# EAGLE schematic roverPCB (EAGLE 9.2.2)
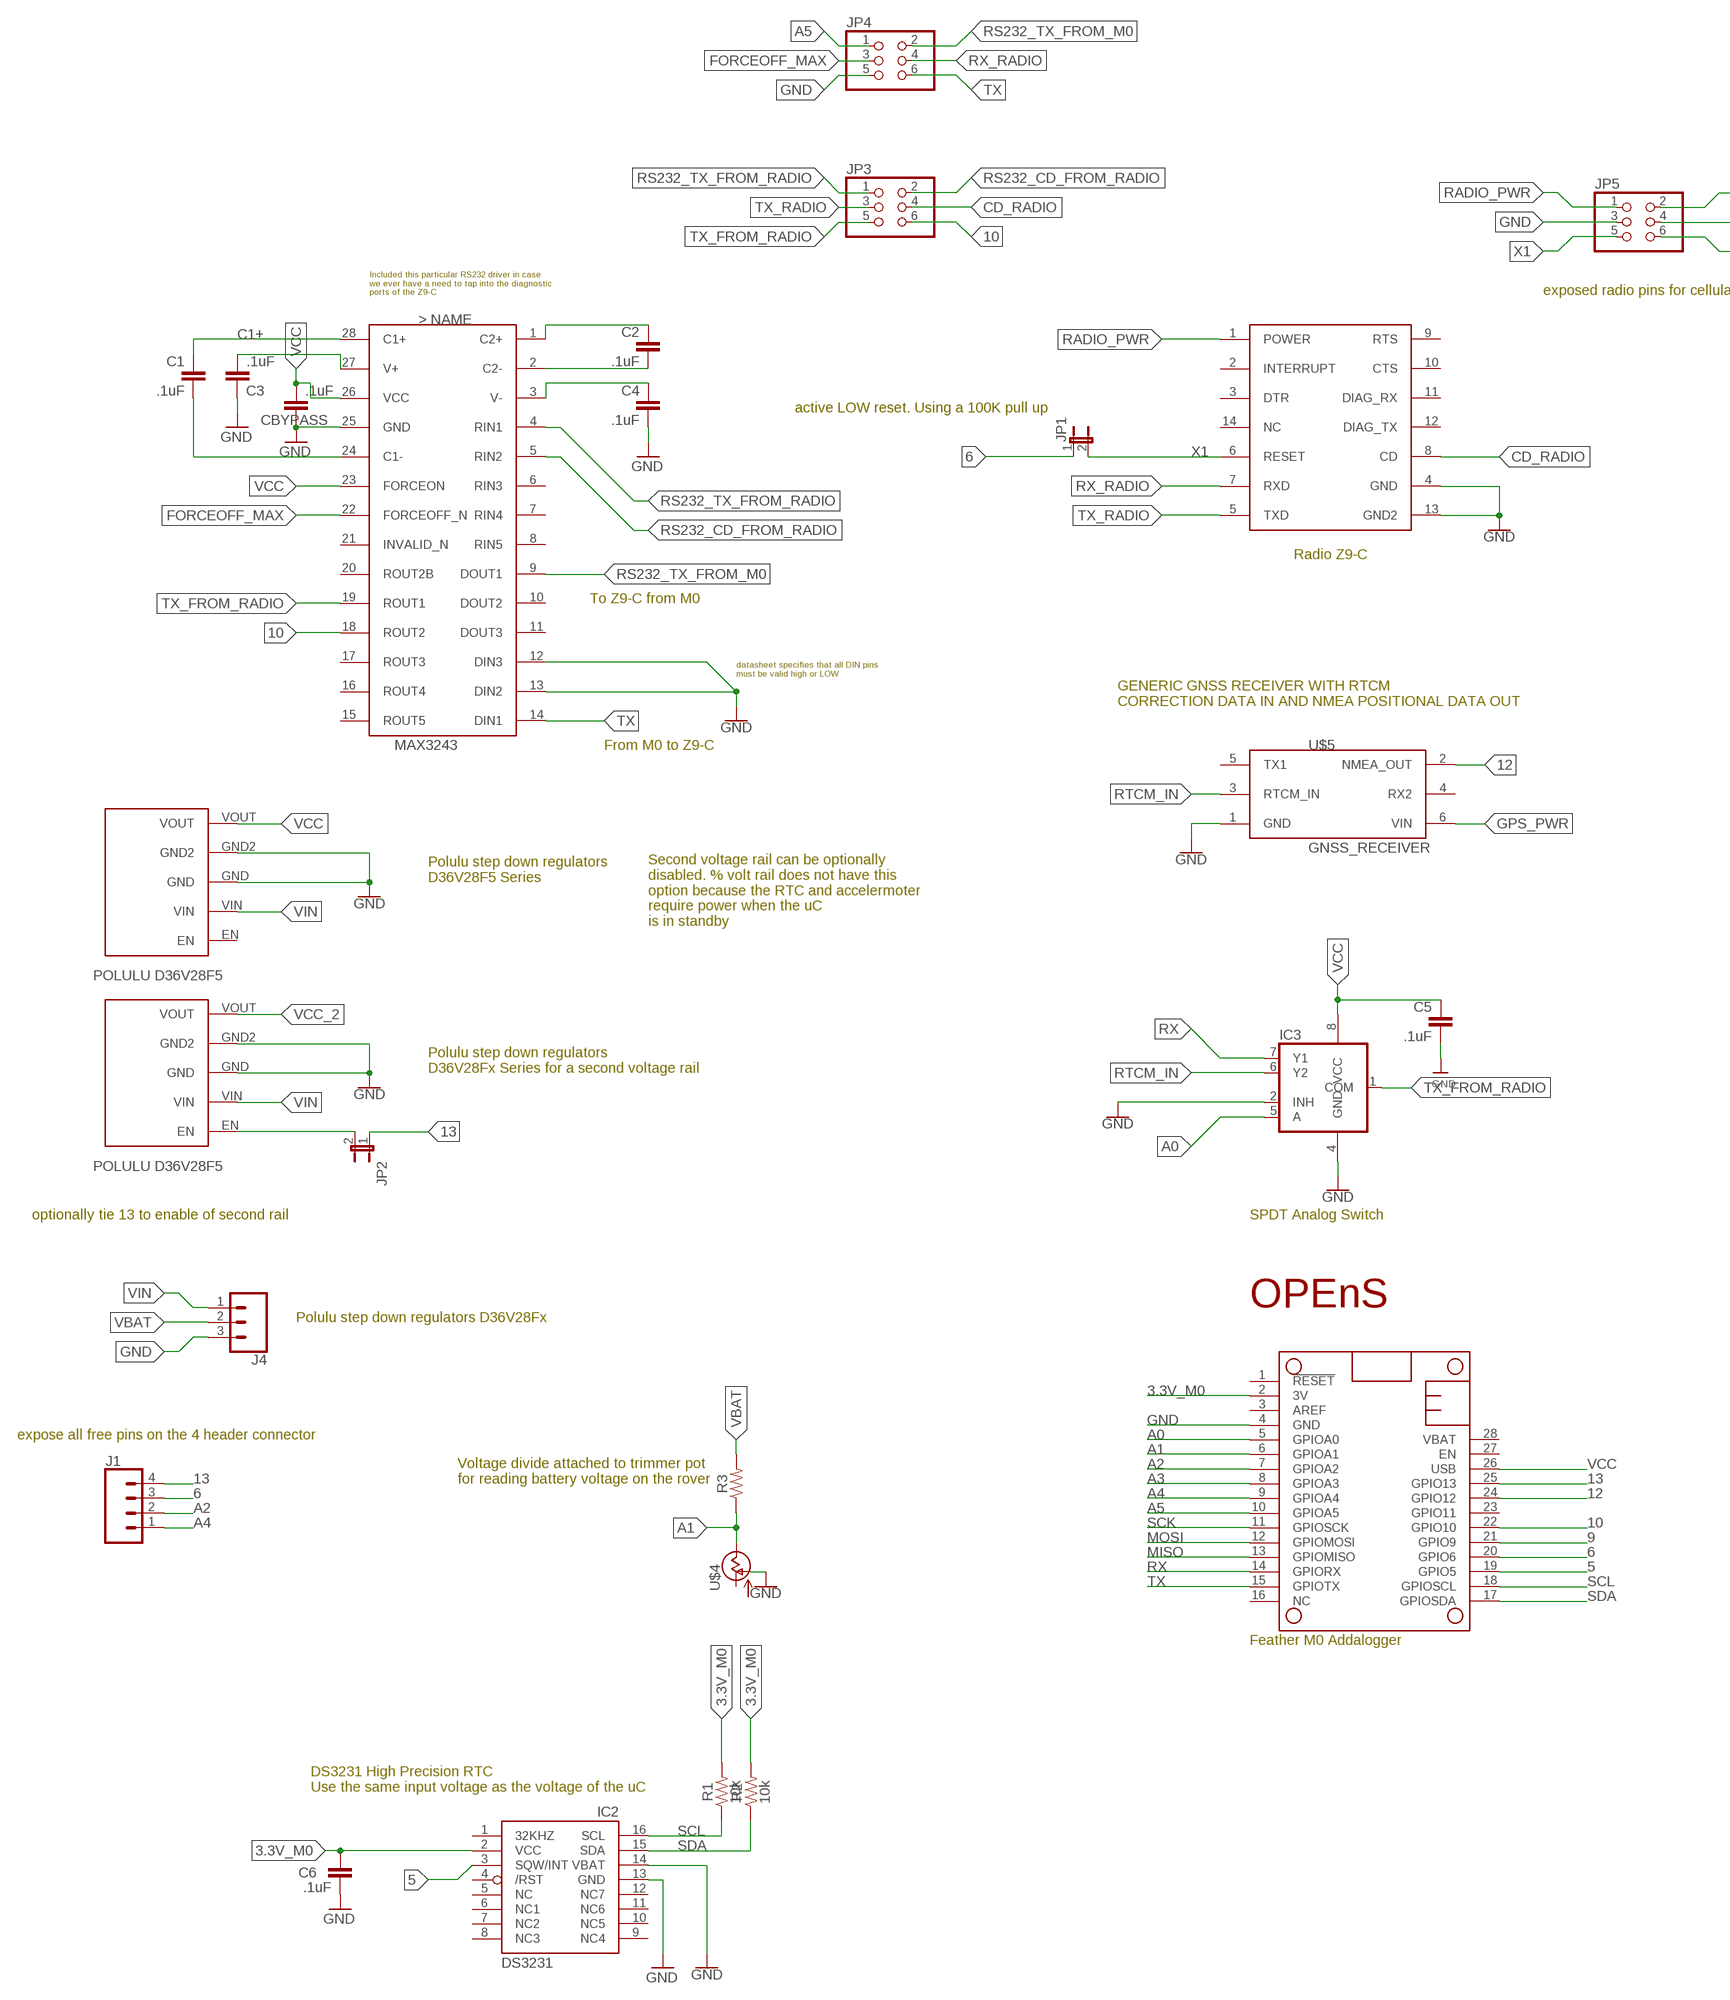
[diagram p0: schematic, sheet 1, part 1 of 2]
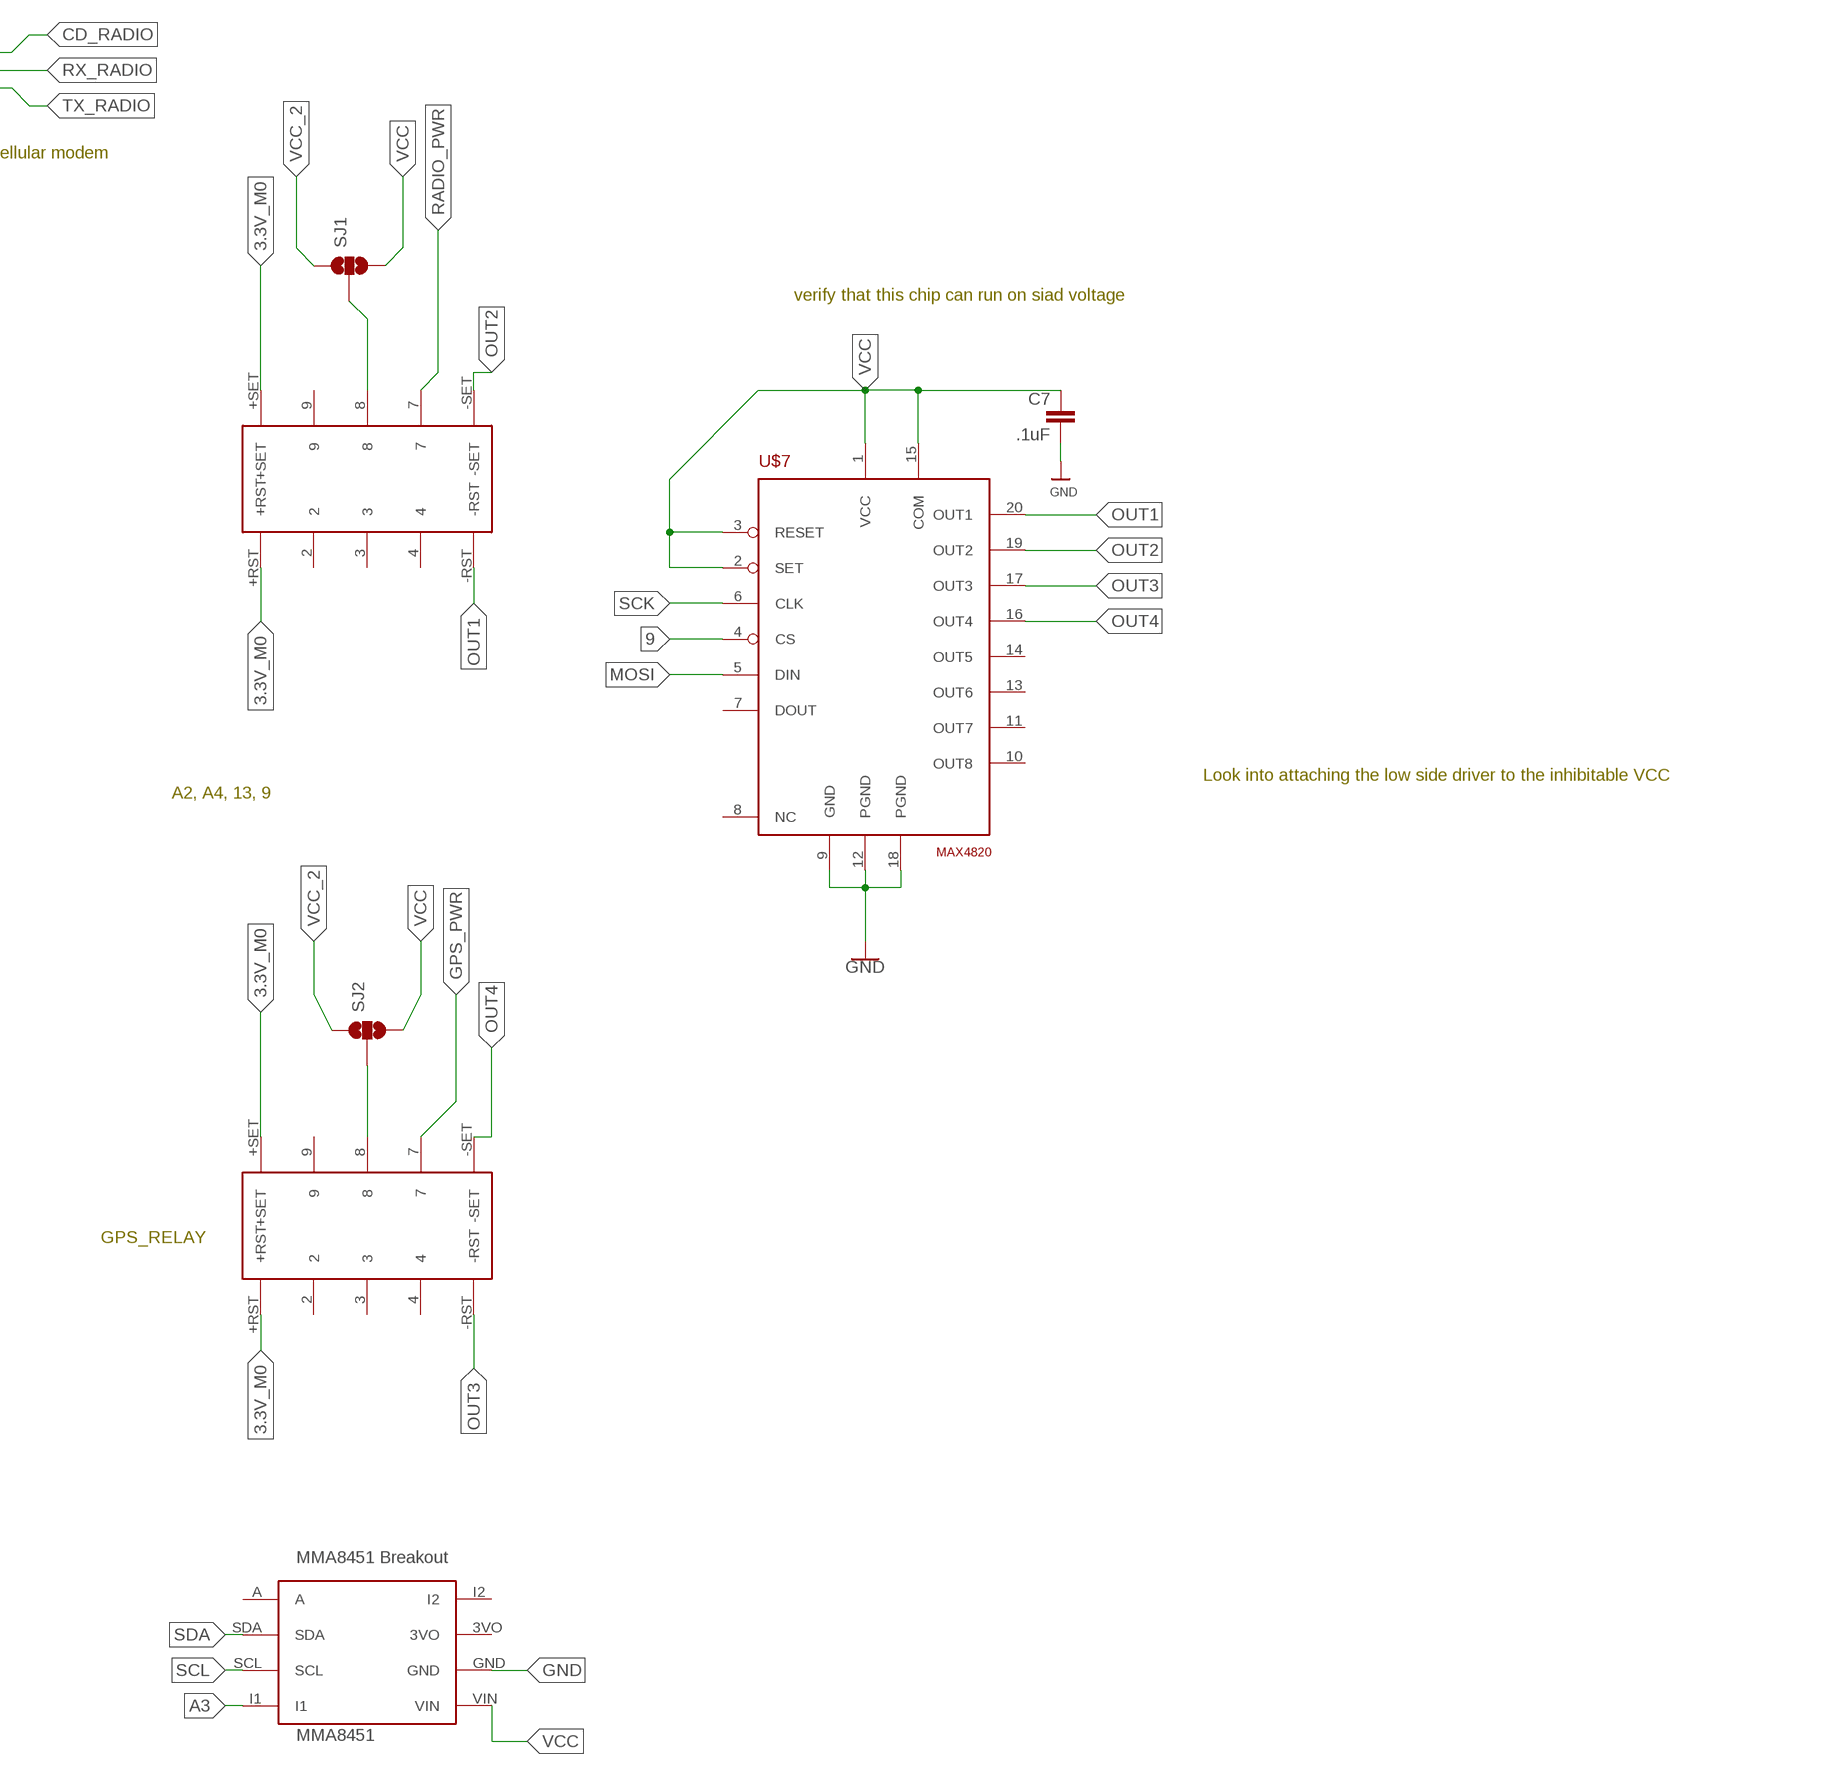
[diagram p1: schematic, sheet 1, part 2 of 2]

## Parts
C1  .1uF  CC1206  [C1206]
C2  .1uF  CC1206  [C1206]
C3  .1uF  CC1206  [C1206]
C4  .1uF  CC1206  [C1206]
C5  .1uF  CC1206  [C1206]
C6  .1uF  CC1206  [C1206]
C7  .1uF  CC1206  [C1206]
CBYPASS  .1uF  CC1206  [C1206]
IC2  DS3231/SO  [SO16W]
IC3  741G53DCT  [DCT_R-PDSO-G8]
J1  CONN_04  [1X04]
J4  CONN_03SCREW  [SCREWTERMINAL-3.5MM-3]
JP1  JP1E  [JP1]
JP2  JP1E  [JP1]
JP3  PINHD-2X3  [2X03]
JP4  PINHD-2X3  [2X03]
JP5  PINHD-2X3  [2X03]
MS1  FEATHERWING  [FEATHERWING]
R1  10k  0.27OHM-0603-1/10W-1%  [0603]
R2  10k  0.27OHM-0603-1/10W-1%  [0603]
R3  1.6KOHM-0603-1/10W-1%  [0603]
SJ1  SOLDERJUMPER_2WAY-OLDT  [SJ_2]
SJ2  SOLDERJUMPER_2WAY-OLDT  [SJ_2]
U$1  MAX3243  [SSOP-28]
U$2  OPENS-LOGO  [OPENS-LOGO]
U$3  POLULU_D36V28FX  [POLULU_D36V28FX]
U$4  CT6EP205  [CT6]
U$5  GNSS_RECEIVER  [MA03-2]
U$7  MAX4820  [TSSOP20]
U$8  TQ2SS  [TQ2SS]
U$9  TQ2SS  [TQ2SS]
U$11  Z9-T/Z9-C  [Z9-T/Z9-C]
U$12  POLULU_D36V28FX  [POLULU_D36V28FX]
U$13  MMA8451  [MMA8451]

## Nets
3.3V_M0: C6.1 IC2.2(VCC) MS1.2(3V) R1.2 R2.2 U$8.+RST U$8.+SET U$9.+RST U$9.+SET
5: IC2.3(SQW/INT) MS1.19(GPIO5)
6: J1.3 JP1.1 MS1.20(GPIO6)
9: MS1.21(GPIO9) U$7.4(CS)
10: JP3.6 MS1.22(GPIO10) U$1.18(ROUT2)
12: MS1.24(GPIO12) U$5.2(NMEA_OUT)
13: J1.4 JP2.1 MS1.25(GPIO13)
A0: IC3.5(A) MS1.5(GPIOA0)
A1: MS1.6(GPIOA1) R3.1 U$4.S(VSS)
A2: J1.2 MS1.7(GPIOA2)
A3: MS1.8(GPIOA3) U$13.I1
A4: J1.1 MS1.9(GPIOA4)
A5: JP4.1 MS1.10(GPIOA5)
C1+: C1.1 U$1.28(C1+)
CD_RADIO: JP3.4 JP5.2 U$11.8(CD)
FORCEOFF_MAX: JP4.3 U$1.22(FORCEOFF_N)
GND: C3.1 C4.2 C5.2 C6.2 C7.2 CBYPASS.1 IC2.13(GND) IC2.14(VBAT) IC3.2(INH) IC3.4(GND) J4.3 JP4.5 JP5.3 MS1.4(GND) U$1.12(DIN3) U$1.13(DIN2) U$1.25(GND) U$3.GND U$3.GND2 U$4.A(OUT) U$5.1(GND) U$7.9(GND) U$7.12(PGND) U$7.18(PGND) U$11.4(GND) U$11.13(GND2) U$12.GND U$12.GND2 U$13.GND
GPS_PWR: U$5.6(VIN) U$9.7
MISO: MS1.13(GPIOMISO)
MOSI: MS1.12(GPIOMOSI) U$7.5(DIN)
N$1: SJ2.2 U$9.8
N$2: SJ1.2 U$8.8
N$4: C2.1 U$1.1(C2+)
N$5: C2.2 U$1.2(C2-)
N$10: C4.1 U$1.3(V-)
N$11: C1.2 U$1.24(C1-)
N$13: C3.2 U$1.27(V+)
OUT1: U$7.20(OUT1) U$8.-RST
OUT2: U$7.19(OUT2) U$8.-SET
OUT3: U$7.17(OUT3) U$9.-RST
OUT4: U$7.16(OUT4) U$9.-SET
RADIO_PWR [Power]: JP5.1 U$8.7 U$11.1(POWER)
RS232_CD_FROM_RADIO: JP3.2 U$1.5(RIN2)
RS232_TX_FROM_M0: JP4.2 U$1.9(DOUT1)
RS232_TX_FROM_RADIO: JP3.1 U$1.4(RIN1)
RTCM_IN: IC3.6(Y2) U$5.3(RTCM_IN)
RX: IC3.7(Y1) MS1.14(GPIORX)
RX_RADIO: JP4.4 JP5.4 U$11.7(RXD)
SCK: MS1.11(GPIOSCK) U$7.6(CLK)
SCL: IC2.16(SCL) MS1.18(GPIOSCL) R1.1 U$13.SCL
SDA: IC2.15(SDA) MS1.17(GPIOSDA) R2.1 U$13.SDA
TX: JP4.6 MS1.15(GPIOTX) U$1.14(DIN1)
TX_FROM_RADIO: IC3.1(COM) JP3.5 U$1.19(ROUT1)
TX_RADIO: JP3.3 JP5.6 U$11.5(TXD)
VBAT: J4.2 R3.2
VCC: C5.1 C7.1 CBYPASS.2 IC3.8(VCC) MS1.26(USB) SJ1.3 SJ2.3 U$1.23(FORCEON) U$1.26(VCC) U$3.VOUT U$7.1(VCC) U$7.2(SET) U$7.3(RESET) U$7.15(COM) U$13.VIN
VCC_2: SJ1.1 SJ2.1 U$12.VOUT
VIN: J4.1 U$3.VIN U$12.VIN
X1: JP1.2 JP5.5 U$11.6(RESET)
X2: JP2.2 U$12.EN
Unconnected: IC2.1(32KHZ) IC2.4(/RST) IC2.5(NC) IC2.6(NC1) IC2.7(NC2) IC2.8(NC3) IC2.9(NC4) IC2.10(NC5) IC2.11(NC6) IC2.12(NC7) MS1.1(!RESET) MS1.3(AREF) MS1.16(NC) MS1.23(GPIO11) MS1.27(EN) MS1.28(VBAT) U$1.6(RIN3) U$1.7(RIN4) U$1.8(RIN5) U$1.10(DOUT2) U$1.11(DOUT3) U$1.15(ROUT5) U$1.16(ROUT4) U$1.17(ROUT3) U$1.20(ROUT2B) U$1.21(INVALID_N) U$3.EN U$4.E(VDD) U$5.4(RX2) U$5.5(TX1) U$7.7(DOUT) U$7.8(NC) U$7.10(OUT8) U$7.11(OUT7) U$7.13(OUT6) U$7.14(OUT5) U$8.2 U$8.3 U$8.4 U$8.9 U$9.2 U$9.3 U$9.4 U$9.9 U$11.2(INTERRUPT) U$11.3(DTR) U$11.9(RTS) U$11.10(CTS) U$11.11(DIAG_RX) U$11.12(DIAG_TX) U$11.14(NC) U$13.3VO U$13.A U$13.I2

## Notes on the sheet
- Included this particular RS232 driver in case
  we ever have a need to tap into the diagnostic
  ports of the Z9-C
- exposed radio pins for cellular modem
- active LOW reset. Using a 100K pull up | verify that this chip can run on siad voltage
- Radio Z9-C
- To Z9-C from M0
- datasheet specifies that all DIN pins 
  must be valid high or LOW
- GENERIC GNSS RECEIVER WITH RTCM
  CORRECTION DATA IN AND NMEA POSITIONAL DATA OUT
- From M0 to Z9-C
- Look into attaching the low side driver to the inhibitable VCC
- A2, A4, 13, 9
- Polulu step down regulators 
  D36V28F5 Series
- Second voltage rail can be optionally
  disabled. % volt rail does not have this
  option because the RTC and accelermoter
  require power when the uC
  is in standby
- Polulu step down regulators 
  D36V28Fx Series for a second voltage rail
- GPS_RELAY
- optionally tie 13 to enable of second rail | SPDT Analog Switch
- Polulu step down regulators D36V28Fx
- expose all free pins on the 4 header connector
- Voltage divide attached to trimmer pot 
  for reading battery voltage on the rover
- Feather M0 Addalogger
- DS3231 High Precision RTC
  Use the same input voltage as the voltage of the uC

## Library data of the parts
C1-C7 CBYPASS = eagle-ltspice:C: CAPACITOR, European symbol; SPICEMODEL: NONE; SPICEPREFIX: C
IC2 = adafruit:DS3231
IC3 = 74xx-little-de:74*1G53: SINGLE-POLE DOUBLE-THROW (SPDT) ANALOG SWITCH 2:1 ANALOG MULTIPLEXER/DEMULTIPLEXER Source: http://focus.ti.com/lit/ds/symlink/sn74lvc2g53.pdf
J1 = SparkFun-Connectors:CONN_04: Multi connection point. Often used as Generic Header-pin footprint for 0.1 inch spaced/style header connections On any of the 0.1 inch spaced packages, you can populate with these: Break Away Headers - Straight <https://www.sparkfun.com/products/116> (PRT-00116) Break Away Male Headers - Right Angle <https://www.sparkfun.com/products/553> (PRT-00553) Female Headers <https://www.sparkfun.com/products/115> (PRT-00115) Break Away Headers - Machine Pin <https://www.sparkfun.com/products/117> (PRT-00117) Break Away Female Headers - Swiss Machine Pin <https://www.sparkfun.com/products/743> (PRT-00743) For SCREWTERMINALS and SPRING TERMINALS visit here: Screw Terimnals on SparkFun.com <https://www.sparkfun.com/search/results?term=Screw+Terminals> (5mm/3.5mm/2.54mm spacing) This device is also useful as a general connection point to wire up your design to another part of your project. Our various solder wires solder well into these plated through hole pads. Hook-Up Wire - Assortment (Stranded, 22 AWG) <https://www.sparkfun.com/products/11375> (PRT-11375) Hook-Up Wire - Assortment (Solid Core, 22 AWG) <https://www.sparkfun.com/products/11367> (PRT-11367) View the entire wire category on our website here <https://www.sparkfun.com/categories/141> Special notes: Molex polarized connector foot print use with SKU : PRT-08231 with associated crimp pins and housings. 1MM SMD Version SKU: PRT-10208; PROD_ID: CONN-09696
J4 = SparkFun-Connectors:CONN_03: Multi connection point. Often used as Generic Header-pin footprint for 0.1 inch spaced/style header connections On any of the 0.1 inch spaced packages, you can populate with these: Break Away Headers - Straight <https://www.sparkfun.com/products/116> (PRT-00116) Break Away Male Headers - Right Angle <https://www.sparkfun.com/products/553> (PRT-00553) Female Headers <https://www.sparkfun.com/products/115> (PRT-00115) Break Away Headers - Machine Pin <https://www.sparkfun.com/products/117> (PRT-00117) Break Away Female Headers - Swiss Machine Pin <https://www.sparkfun.com/products/743> (PRT-00743) Stackable Header - 3 Pin (Female, 0.1") <https://www.sparkfun.com/products/13875> (PRT-13875) For SCREWTERMINALS and SPRING TERMINALS visit here: Screw Terimnals on SparkFun.com <https://www.sparkfun.com/search/results?term=Screw+Terminals> (5mm/3.5mm/2.54mm spacing) This device is also useful as a general connection point to wire up your design to another part of your project. Our various solder wires solder well into these plated through hole pads. Hook-Up Wire - Assortment (Stranded, 22 AWG) <https://www.sparkfun.com/products/11375> (PRT-11375) Hook-Up Wire - Assortment (Solid Core, 22 AWG) <https://www.sparkfun.com/products/11367> (PRT-11367) View the entire wire category on our website here <https://www.sparkfun.com/categories/141> Special notes: Molex polarized connector foot print use with SKU : PRT-08232 with associated crimp pins and housings.; PROD_ID: CONN-08288; SF_ID: PRT-08235
JP1 JP2 = jumper:JP1E: JUMPER
JP3-JP5 = pinhead:PINHD-2X3: PIN HEADER
MS1 = adafruit:FEATHERWING
R1 R2 = SparkFun-Resistors:0.27OHM: 0.27Ω resistor A resistor is a passive two-terminal electrical component that implements electrical resistance as a circuit element. Resistors act to reduce current flow, and, at the same time, act to lower voltage levels within circuits. - Wikipedia; PROD_ID: RES-08787; VALUE: 0.27
R3 = SparkFun-Resistors:1.6KOHM: 1.6kΩ resistor A resistor is a passive two-terminal electrical component that implements electrical resistance as a circuit element. Resistors act to reduce current flow, and, at the same time, act to lower voltage levels within circuits. - Wikipedia; PROD_ID: RES-08361; VALUE: 1.6k
SJ1 SJ2 = SparkFun-Retired:SOLDERJUMPER_2WAY-OLD: Solder Jumper 2 way solder jumper
U$1 = ftdi4:MAX3243: MAX3243 RS232 interface 5 receive lines 3 line drives 5V or 3.3V operating voltage
U$2 = opens-logo:OPENS-LOGO: OPENS Lab Logo
U$3 U$12 = SlideSentinel:POLULU_D36V28FX
U$4 = tango:CT6EP205
U$5 = SlideSentinel:GNSS_RECEIVER
U$7 = MAX4820:MAX4820
U$8 U$9 = SlideSentinel:TQ2SS
U$11 = SlideSentinel:Z9-T/Z9-C
U$13 = SlideSentinel:MMA8451

## Net classes
0 default: width 0.305 mm, drill 0.508 mm, clearance 0.254 mm
1 Power: width 0.635 mm, drill 1.27 mm, clearance 0.508 mm